# EAGLE design MC-Breakout (EAGLE 9.6.2)
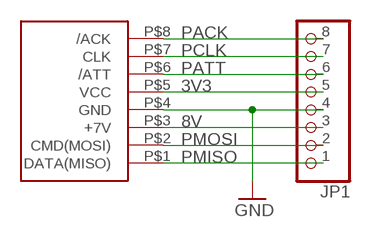
[diagram p0: schematic, sheet 1]

## Parts
JP1  PINHD-1X8  [1X08]
U$2  MEMORYCARD_EDGE  [PSX_MEMCARD_EDGE]

## Nets
3V3: JP1.5 U$2.P$5(VCC)
8V: JP1.3 U$2.P$3(+7V)
GND: JP1.4 U$2.P$4(GND)
PACK: JP1.8 U$2.P$8(/ACK)
PATT: JP1.6 U$2.P$6(/ATT)
PCLK: JP1.7 U$2.P$7(CLK)
PMISO: JP1.1 U$2.P$1(DATA(MISO))
PMOSI: JP1.2 U$2.P$2(CMD(MOSI))

## Library data of the parts
JP1 = pinhead:PINHD-1X8: PIN HEADER
U$2 = PSX:MEMORYCARD_EDGE

## Board
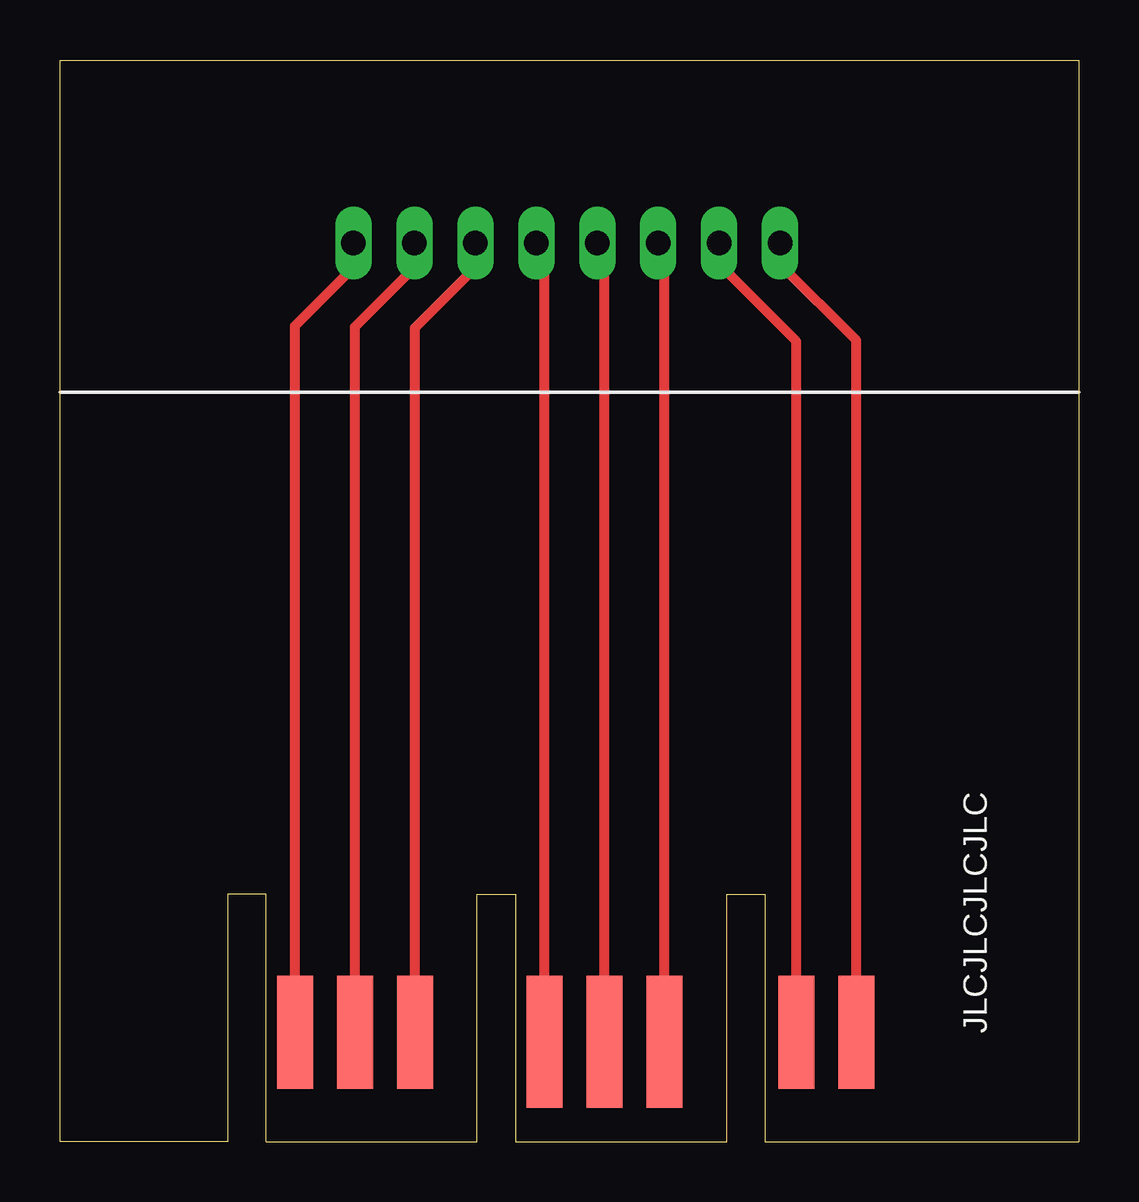
[diagram p1: board, top side]
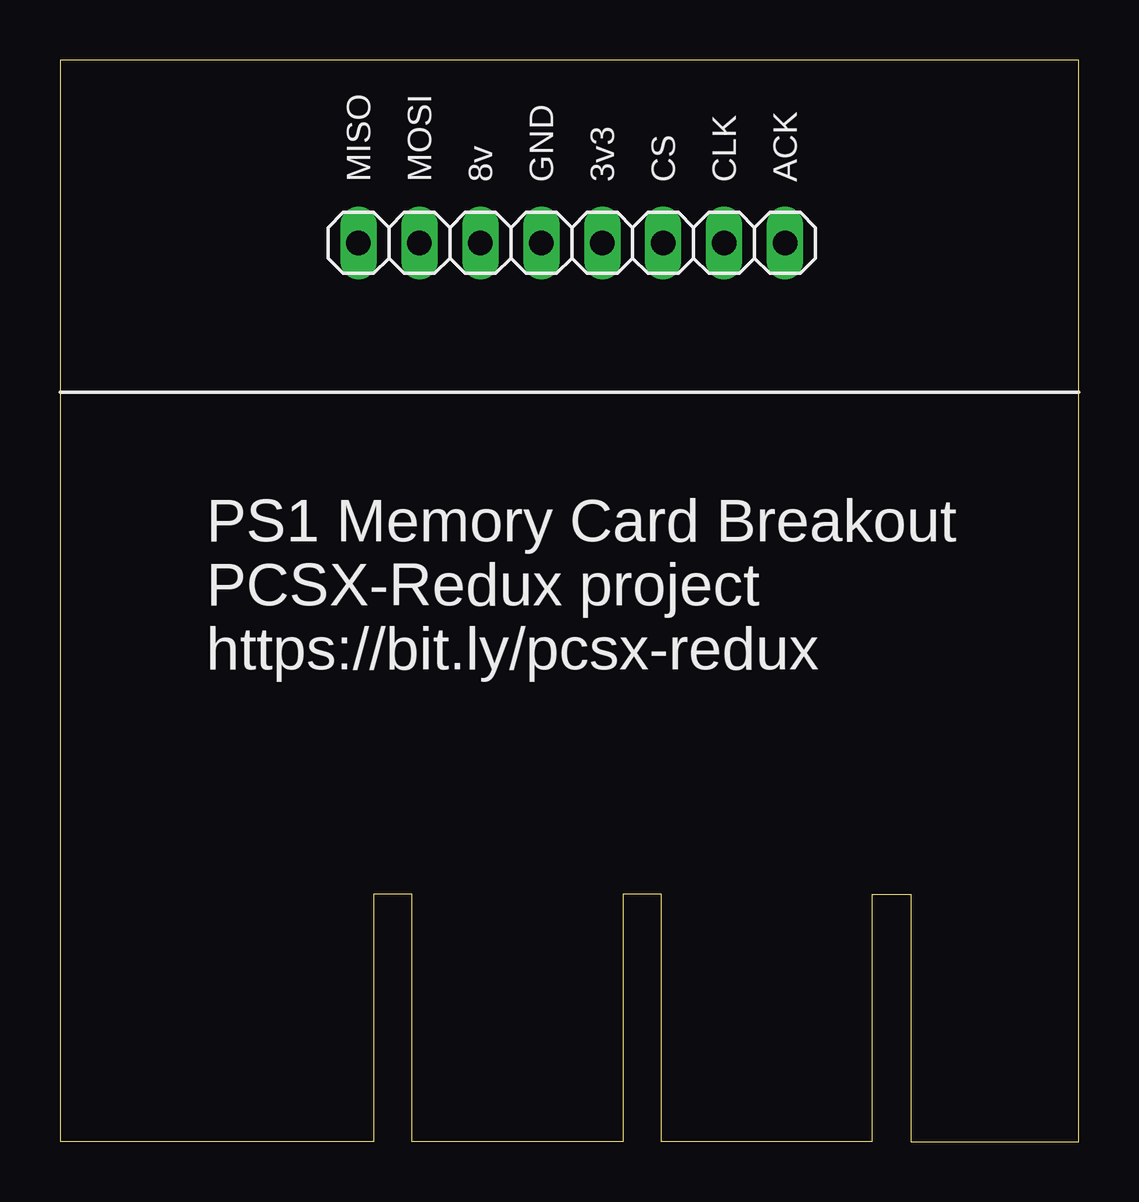
[diagram p2: board, bottom side, seen from below]

Size 42.46 x 45.06 mm. Coordinates in mm from the lower left corner, seen from the top.
Outline: 8.59,0 17.39,0 17.39,10.3 18.99,10.3 18.99,0 27.79,0 27.79,10.3 29.39,10.3 29.39,0 42.46,0 42.46,45.06 0,45.06 0,0 6.99,0 6.99,10.3 8.59,10.3 8.59,0
Copper layers (1*16): Top 0.035mm / dielectric 1.5mm / Bottom 0.035mm
Design rules "default *": minimum track width 6mil, minimum drill 0.35mm, track to track 6mil, track to pad 6mil, pad to pad 6mil, via to via 6mil, smd to smd 6mil, copper to edge 0.2mm, drill to drill 6mil, minimum pad ring 10mil, minimum via ring 8mil, stop-mask expansion 4mil, vias tented up to drill 20mil, thermal gap 10mil

### Footprints (pad centres in the part's own frame; a part is rotated, then mirrored left to right if it is on the bottom)
1X08 = drill 1.016 long: 1 -8.89,0; 2 -6.35,0; 3 -3.81,0; 4 -1.27,0; 5 1.27,0; 6 3.81,0; 7 6.35,0; 8 8.89,0
PSX_MEMCARD_EDGE = smd 1.5 x 4.7: P$1 0,0; P$2 -2.5,0; P$6 -18.4,0; P$7 -20.9,0; P$8 -23.4,0 | smd 1.5 x 5.5: P$3 -8,-0.4; P$4 -10.5,-0.4; P$5 -13,-0.4

### Placement (x,y rotation side)
JP1  21.13,37.44 0 bottom
U$2  33.19,4.55 0 top

### Tracks (layer width: path | path; a pad name or v marks a point on that pad's centre or on a via)
3V3
  Top 0.406: U$2.P$5 20.19,36.09 19.86,36.43 JP1.5
8V
  Top 0.406: U$2.P$3 25.19,36.04 25,36.24 24.94,36.3 JP1.3
GND
  Top 0.406: U$2.P$4 22.69,36 22.46,36.24 22.4,36.3 JP1.4
PACK
  Top 0.406: U$2.P$8 9.79,33.98 12.24,36.43 JP1.8
PATT
  Top 0.406: U$2.P$6 14.79,33.9 17.19,36.3 17.32,36.43 JP1.6
PCLK
  Top 0.406: U$2.P$7 12.29,33.94 14.78,36.43 JP1.7
PMISO
  Top 0.406: U$2.P$1 33.19,33.38 30.02,36.55 JP1.1
PMOSI
  Top 0.406: U$2.P$2 30.69,33.34 27.67,36.36 27.48,36.55 JP1.2

### Text on the board
tPlace: JLCJLCJLCJLC
bNames: ACK | CLK | CS | 3v3 | GND | 8v | MOSI | MISO | PS1 Memory Card Breakout / PCSX-Redux project / https://bit.ly/pcsx-redux